# EAGLE design theremin_gross_mono (EAGLE 5.10)
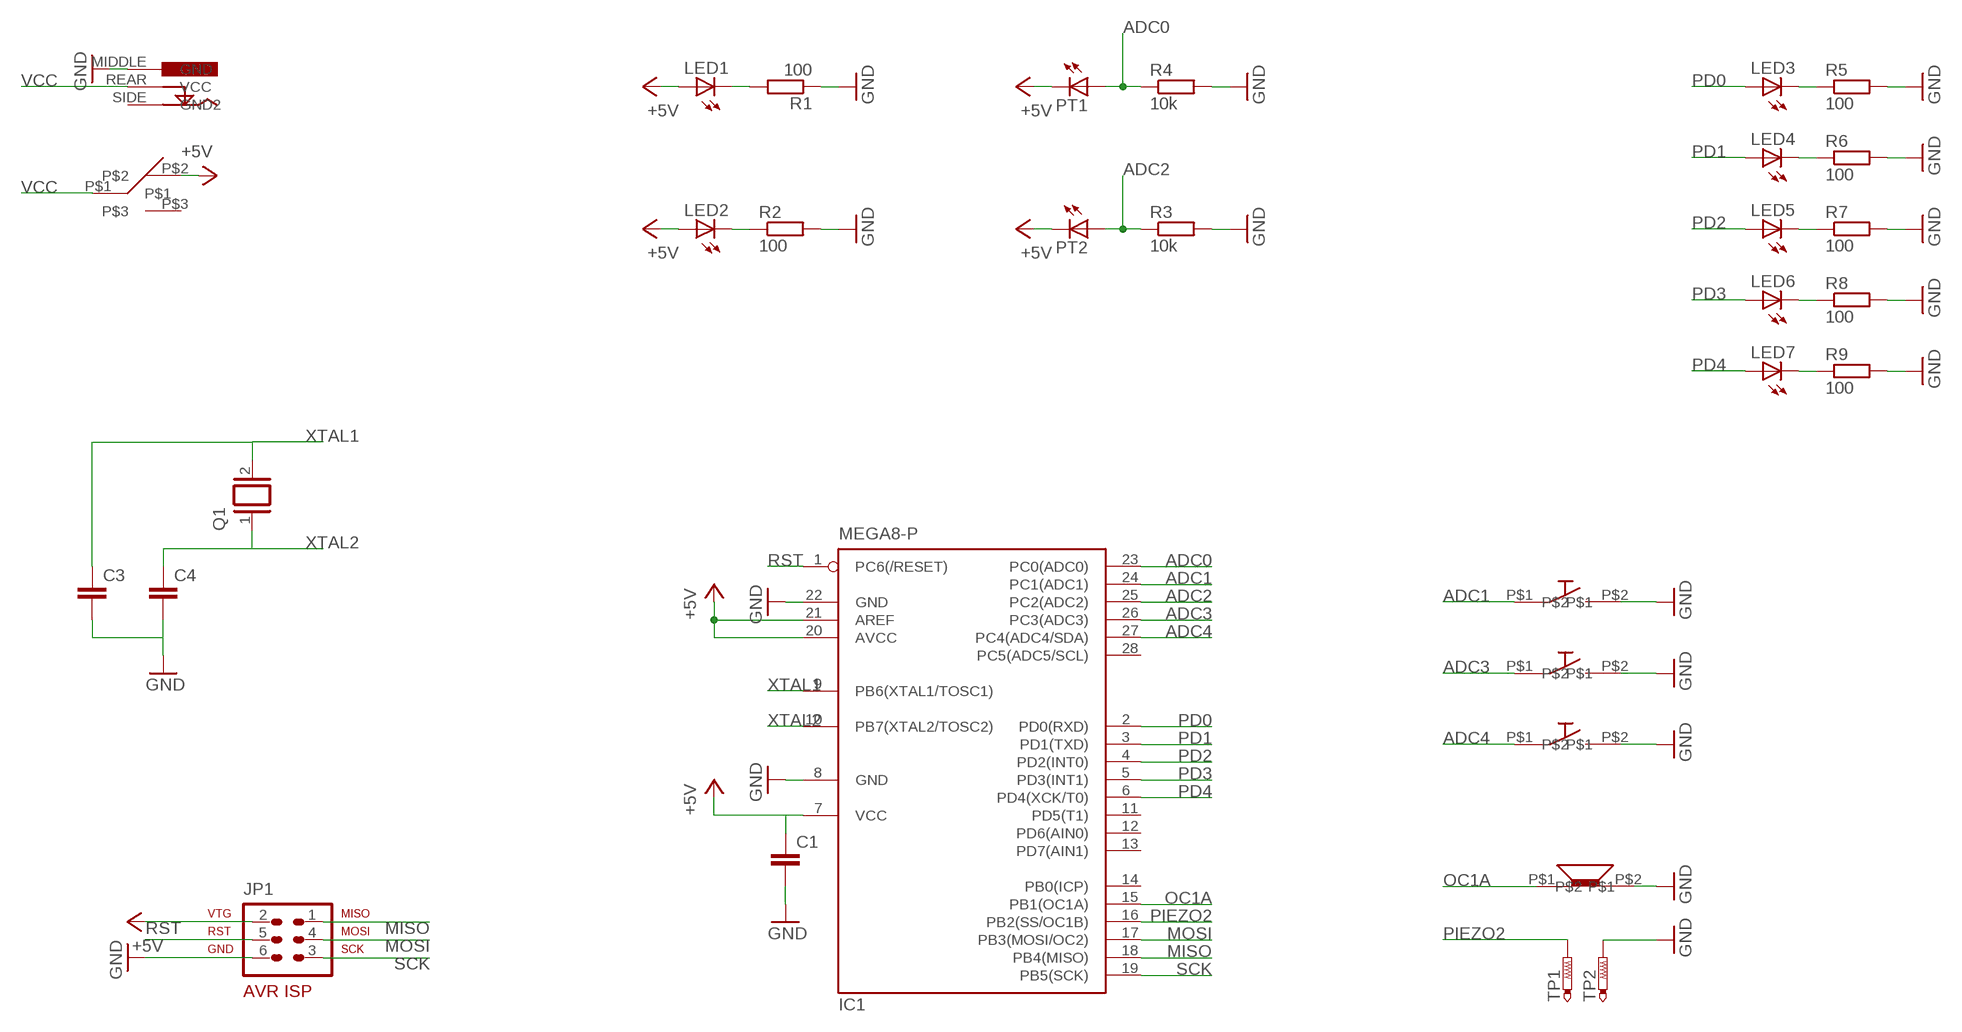
[diagram p0: schematic, sheet 1]

## Parts
C1  C-EU025-025X050  [C025-025X050]
C3  C-EU025-025X050  [C025-025X050]
C4  C-EU025-025X050  [C025-025X050]
IC1  MEGA8-P  [DIL28-3]
JP1  AVR-ISP-6  [AVR-ISP-6]
LED1  LED3MM  [LED3MM]
LED2  LED3MM  [LED3MM]
LED3  LED3MM  [LED3MM]
LED4  LED3MM  [LED3MM]
LED5  LED3MM  [LED3MM]
LED6  LED3MM  [LED3MM]
LED7  LED3MM  [LED3MM]
PT1  LED3MM  [LED3MM]
PT2  LED3MM  [LED3MM]
Q1  XTAL/S  [QS]
R1  100  R-EU_0207/10  [0207/10]
R2  100  R-EU_0207/10  [0207/10]
R3  10k  R-EU_0207/10  [0207/10]
R4  10k  R-EU_0207/10  [0207/10]
R5  100  R-EU_0207/10  [0207/10]
R6  100  R-EU_0207/10  [0207/10]
R7  100  R-EU_0207/10  [0207/10]
R8  100  R-EU_0207/10  [0207/10]
R9  100  R-EU_0207/10  [0207/10]
TP1  PTR1PAD1-20  [P1-20]
TP2  PTR1PAD1-20  [P1-20]
U$1  TASTER1032  [TASTER1032]
U$2  JACK-2.1MM  [JACK-2.1MM]
U$3  SCHALTER-KIP1PUM  [CSD-KIP1PUM]
U$4  PIEZO-A3  [PIEZO-A3]
U$6  TASTER1032  [TASTER1032]
U$7  TASTER1032  [TASTER1032]

## Nets
+5V: C1.1 IC1.7(VCC) IC1.20(AVCC) IC1.21(AREF) JP1.2 LED1.A LED2.A PT1.K(C) PT2.K(C) U$3.P$2
ADC0: IC1.23(PC0(ADC0)) PT1.A R4.1
ADC1: IC1.24(PC1(ADC1)) U$1.P$1
ADC2: IC1.25(PC2(ADC2)) PT2.A R3.1
ADC3: IC1.26(PC3(ADC3)) U$6.P$1
ADC4: IC1.27(PC4(ADC4/SDA)) U$7.P$1
GND: C1.2 C3.2 C4.2 IC1.8(GND) IC1.22(GND) JP1.6 R1.1 R2.2 R3.2 R4.2 R5.2 R6.2 R7.2 R8.2 R9.2 TP2.TP U$1.P$2 U$2.MIDDLE(GND) U$4.P$2 U$6.P$2 U$7.P$2
MISO: IC1.18(PB4(MISO)) JP1.1
MOSI: IC1.17(PB3(MOSI/OC2)) JP1.4
N$1: LED2.K(C) R2.1
N$2: LED1.K(C) R1.2
N$3: LED3.K(C) R5.1
N$5: LED4.K(C) R6.1
N$7: LED5.K(C) R7.1
N$9: LED6.K(C) R8.1
N$11: LED7.K(C) R9.1
OC1A: IC1.15(PB1(OC1A)) U$4.P$1
PD0: IC1.2(PD0(RXD)) LED3.A
PD1: IC1.3(PD1(TXD)) LED4.A
PD2: IC1.4(PD2(INT0)) LED5.A
PD3: IC1.5(PD3(INT1)) LED6.A
PD4: IC1.6(PD4(XCK/T0)) LED7.A
PIEZO2: IC1.16(PB2(SS/OC1B)) TP1.TP
RST: IC1.1(PC6(/RESET)) JP1.5
SCK: IC1.19(PB5(SCK)) JP1.3
VCC: U$2.REAR(VCC) U$3.P$1
XTAL1: C3.1 IC1.9(PB6(XTAL1/TOSC1)) Q1.2
XTAL2: C4.1 IC1.10(PB7(XTAL2/TOSC2)) Q1.1
Unconnected: IC1.11(PD5(T1)) IC1.12(PD6(AIN0)) IC1.13(PD7(AIN1)) IC1.14(PB0(ICP)) IC1.28(PC5(ADC5/SCL)) U$2.SIDE(GND2) U$3.P$3

## Library data of the parts
C1 C3 C4 = resistor:C-EU: CAPACITOR, European symbol
IC1 = atmel:MEGA8-P: MICROCONTROLLER 8 Kbytes FLASH, 1 kbytes SRAM, 512 bytes EEPROM, USART, 4-channel 10 bit ADC, 2-channel 8 bit ADC Pin compatible with Atmega48, ATMega88, ATMega168 Source: avr.lbr
JP1 = avr-6:AVR-ISP-6: AVR ISP-6 Serial Programming Header
LED1-LED7 PT1 PT2 = led:LED: LED OSRAM: - CHIPLED LG R971, LG N971, LY N971, LG Q971, LY Q971, LO R971, LY R971 LH N974, LH R974 LS Q976, LO Q976, LY Q976 LO Q996 - Hyper CHIPLED LW Q18S LB Q993, LB Q99A, LB R99A - SideLED LS A670, LO A670, LY A670, LG A670, LP A670 LB A673, LV A673, LT A673, LW A673 LH A674 LY A675 LS A676, LA A676, LO A676, LY A676, LW A676 LS A679, LY A679, LG A679 - Hyper Micro SIDELED® LS Y876, LA Y876, LO Y876, LY Y876 LT Y87S - SmartLED LW L88C, LW L88S LB L89C, LB L89S, LG L890 LS L89K, LO L89K, LY L89K LS L896, LA L896, LO L896, LY L896 - TOPLED LS T670, LO T670, LY T670, LG T670, LP T670 LSG T670, LSP T670, LSY T670, LOP T670, LYG T670 LG T671, LOG T671, LSG T671 LB T673, LV T673, LT T673, LW T673 LH T674 LS T676, LA T676, LO T676, LY T676, LB T676, LH T676, LSB T676, LW T676 LB T67C, LV T67C, LT T67C, LS T67K, LO T67K, LY T67K, LW E67C LS E67B, LA E67B, LO E67B, LY E67B, LB E67C, LV E67C, LT E67C LW T67C LS T679, LY T679, LG T679 LS T770, LO T770, LY T770, LG T770, LP T770 LB T773, LV T773, LT T773, LW T773 LH T774 LS E675, LA E675, LY E675, LS T675 LS T776, LA T776, LO T776, LY T776, LB T776 LHGB T686 LT T68C, LB T68C - Hyper Mini TOPLED® LB M676 - Mini TOPLED Santana® LG M470 LS M47K, LO M47K, LY M47K Source: http://www.osram.convergy.de LUXEON: - LUMILED® LXK2-PW12-R00, LXK2-PW12-S00, LXK2-PW14-U00, LXK2-PW14-V00 LXK2-PM12-R00, LXK2-PM12-S00, LXK2-PM14-U00 LXK2-PE12-Q00, LXK2-PE12-R00, LXK2-PE12-S00, LXK2-PE14-T00, LXK2-PE14-U00 LXK2-PB12-K00, LXK2-PB12-L00, LXK2-PB12-M00, LXK2-PB14-N00, LXK2-PB14-P00, LXK2-PB14-Q00 LXK2-PR12-L00, LXK2-PR12-M00, LXK2-PR14-Q00, LXK2-PR14-R00 LXK2-PD12-Q00, LXK2-PD12-R00, LXK2-PD12-S00 LXK2-PH12-R00, LXK2-PH12-S00 LXK2-PL12-P00, LXK2-PL12-Q00, LXK2-PL12-R00 Source: www.luxeon.com KINGBRIGHT: KA-3528ASYC Source: www.kingbright.com
Q1 = special:XTAL/S: CRYSTAL
R1-R9 = resistor:R-EU_: RESISTOR, European symbol
TP1 TP2 = testpad:PTR1: TEST PIN
U$1 U$6 U$7 = theremin:TASTER1032
U$2 = theremin:JACK-2.1MM
U$3 = theremin:SCHALTER-KIP1PUM
U$4 = theremin:PIEZO-A3: pui audio Transducer (Piezo) AT-5210-TT-R

## Board
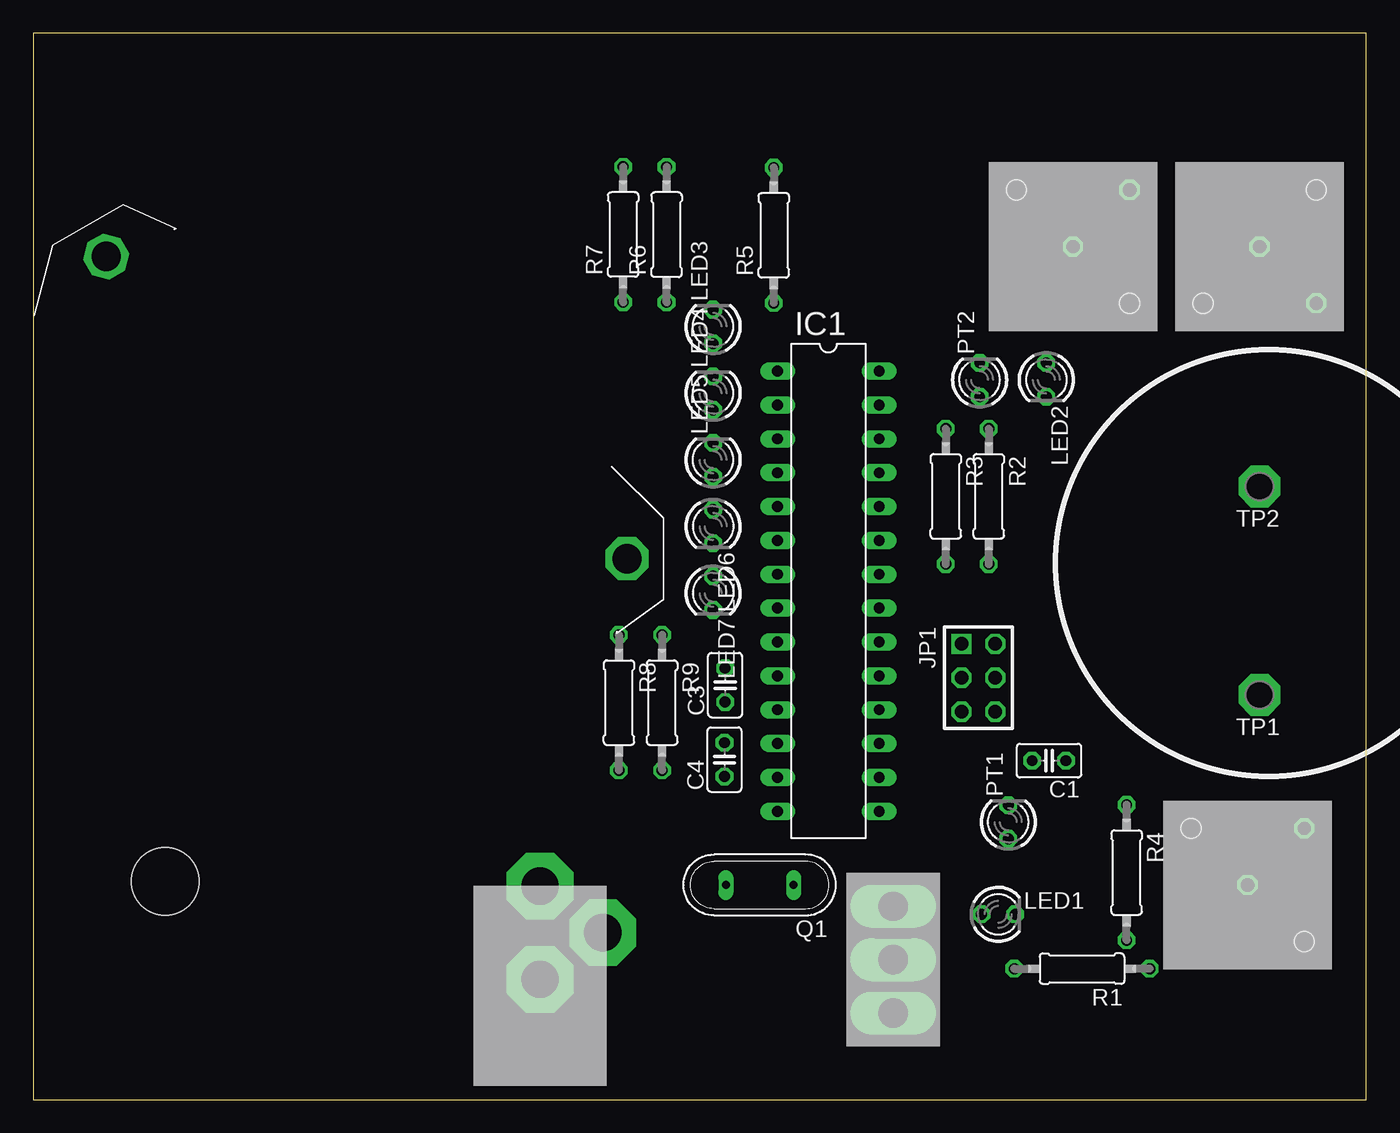
[diagram p1: board, top side]
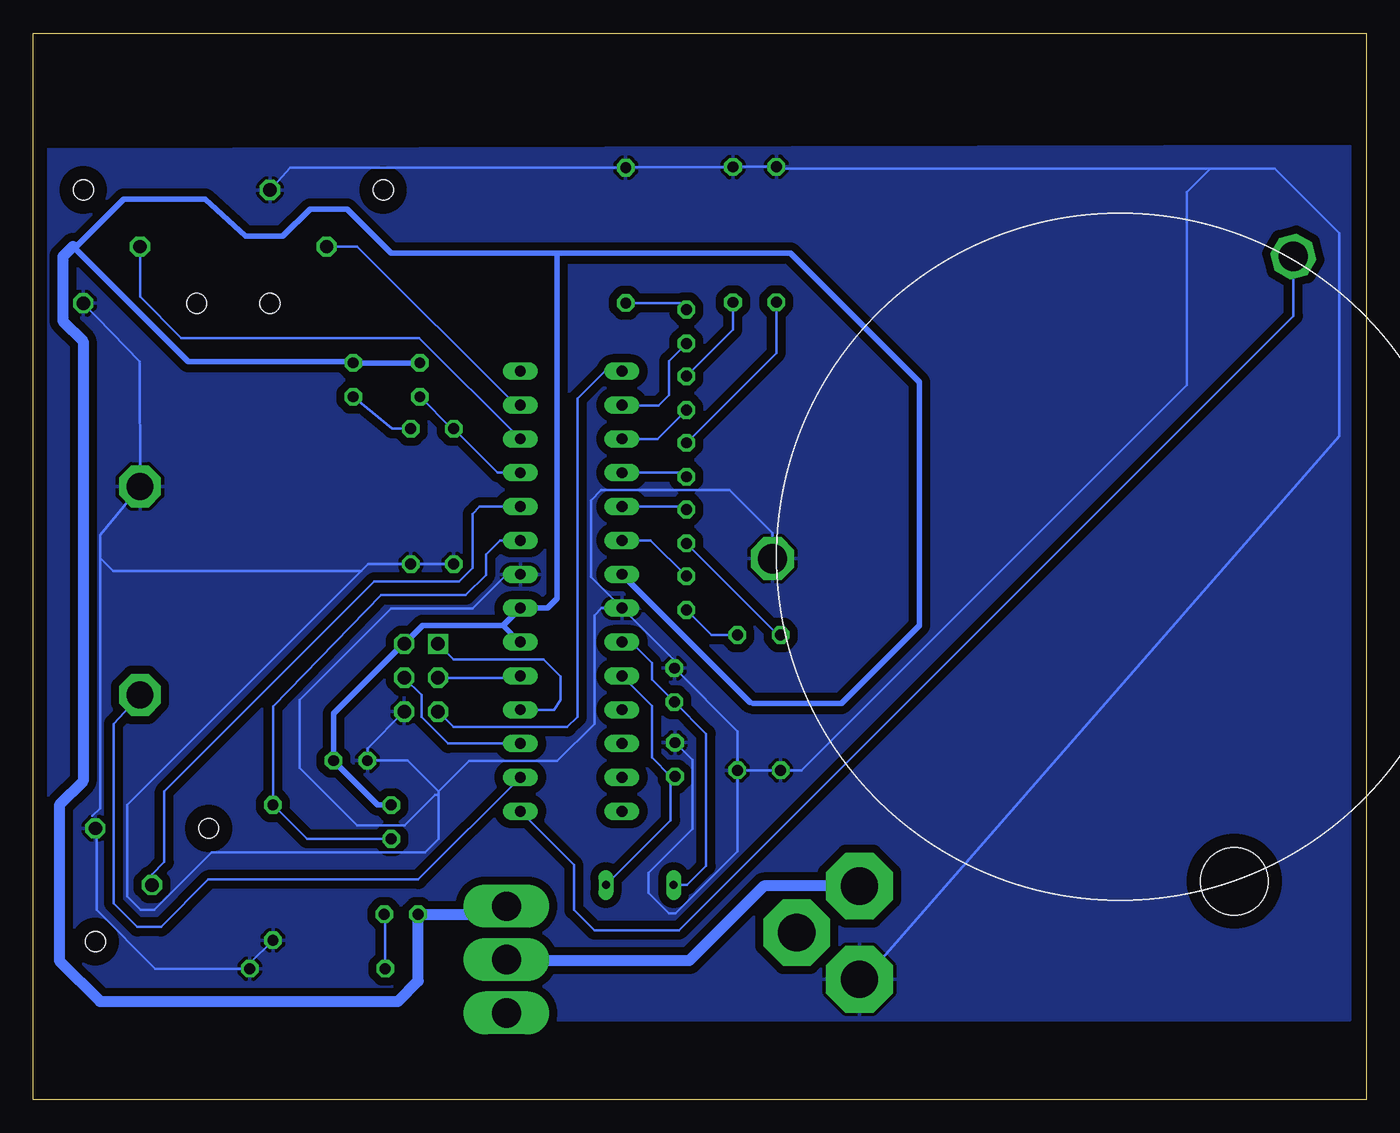
[diagram p2: board, bottom side, seen from below]

Size 100 x 80 mm. Coordinates in mm from the lower left corner, seen from the top.
Outline: 0,0 100,0 100,80 0,80 0,0
Copper layers (1*16): Top 0.035mm / dielectric 1.5mm / Bottom 0.035mm
Design rules "default": minimum track width 10mil, minimum drill 24mil, track to track 8mil, track to pad 8mil, pad to pad 8mil, via to via 8mil, smd to smd 8mil, copper to edge 40mil, drill to drill 8mil, minimum pad ring 10mil, minimum via ring 8mil, stop-mask expansion 4mil, vias tented up to drill 0mil, thermal gap 10mil

### Footprints (pad centres in the part's own frame; a part is rotated, then mirrored left to right if it is on the bottom)
C025-025X050 = drill 0.813 octagon: 1 -1.27,0; 2 1.27,0
DIL28-3 = drill 0.813 long: 1 -16.51,-3.81; 2 -13.97,-3.81; 3 -11.43,-3.81; 4 -8.89,-3.81; 5 -6.35,-3.81; 6 -3.81,-3.81; 7 -1.27,-3.81; 8 1.27,-3.81; 9 3.81,-3.81; 10 6.35,-3.81; 11 8.89,-3.81; 12 11.43,-3.81; 13 13.97,-3.81; 14 16.51,-3.81; 15 16.51,3.81; 16 13.97,3.81; 17 11.43,3.81; 18 8.89,3.81; 19 6.35,3.81; 20 3.81,3.81; 21 1.27,3.81; 22 -1.27,3.81; 23 -3.81,3.81; 24 -6.35,3.81; 25 -8.89,3.81; 26 -11.43,3.81; 27 -13.97,3.81; 28 -16.51,3.81
AVR-ISP-6 = drill 1.016 square: 1 -2.54,-1.27 | drill 1.016 octagon: 2 -2.54,1.27; 3 0,-1.27; 4 0,1.27; 5 2.54,-1.27; 6 2.54,1.27
LED3MM = drill 0.813 octagon: A -1.27,0; K 1.27,0
QS = drill 0.61 long: 1 -2.54,0; 2 2.54,0
0207/10 = drill 0.813 octagon: 1 -5.08,0; 2 5.08,0
P1-20 = drill 2.007 pad 3.15 octagon: TP 0,0
TASTER1032 = drill 1 octagon: P$1 0,0; P$2 4.25,4.25 | hole 1.5: -4.25,4.25; 4.25,-4.25
JACK-2.1MM = drill 2.8 pad 5 octagon: MIDDLE 8,-5; REAR 15,-5; SIDE 11.5,-9.7
CSD-KIP1PUM = drill 2.2 long: P$1 3.5,-6.5; P$2 3.5,-2.5; P$3 3.5,-10.5
PIEZO-A3 = drill 2.2 octagon: P$1 -12.822,22.868; P$2 26.261,0.196 | hole 5.08: -8.382,-24.003

### Placement (x,y rotation side)
C1  76.21,25.43 180 top
C3  51.91,31.1 90 top
C4  51.86,25.51 90 top
IC1  59.65,38.14 270 top
JP1  70.91,31.65 270 top
LED1  72.4,13.9 0 top
LED2  76,54 270 top
LED3  51,58 90 top
LED4  51,53 90 top
LED5  51,48 90 top
LED6  51,43 270 top
LED7  51,38 270 top
PT1  73.15,20.83 90 top
PT2  71,54 90 top
Q1  54.5,16.1 180 top
R1  78.68,9.82 180 top
R2  71.68,45.25 270 top
R3  68.46,45.25 270 top
R4  82.02,17.03 270 top
R5  55.55,64.84 90 top
R6  47.51,64.89 90 top
R7  44.25,64.91 90 top
R8  43.94,29.78 270 top
R9  47.17,29.78 270 top
TP1  92,30.36 180 top
TP2  92,46 180 top
U$1  91.1,16.1 0 top
U$2  33.02,1.02 90 top
U$3  61,17 0 top
U$4  18.29,40.39 0 top
U$6  92,64 270 top
U$7  78,64 0 top

### Tracks (layer width: path | path; a pad name or v marks a point on that pad's centre or on a via)
+5V
  Bottom 0.406: 60.71,63.5 60.71,37.59 61.43,36.87 IC1.21 64.77,35.56 | 64.77,35.56 70.8,35.56 JP1.2 72.24,34.19 77.47,28.96 C1.1 77.48,25.41 74.17,22.1 PT1.K | 96.9,63.88 97.03,64.01 | 96.9,63.88 88.39,55.37 76.1,55.37 LED2.A PT2.K | 60.71,63.5 43.18,63.5 33.53,53.85 33.53,35.56 39.37,29.72 45.97,29.72 46.23,29.8 IC1.7 | 60.71,63.5 73.15,63.5 76.45,66.8 79.25,66.8 81.28,64.77 84.07,64.77 87.12,67.56 93.22,67.56 96.9,63.88 | 64.77,35.56 63.54,34.33 IC1.20
  Bottom 0.813: U$3.P$2 65.1,13.9 LED1.A 71.12,8.89 72.64,7.37 95,7.37 98.04,10.41 98.04,22.1 96.27,23.88 96.27,56.9 97.79,58.42 97.79,63.25 97.03,64.01
ADC0
  Bottom 0.203: PT1.A 79.47,19.56 R4.1 82.02,29.48 73.91,37.85 67.56,37.85 66.04,39.37 66.04,40.89 64.98,41.95 IC1.23
ADC1
  Bottom 0.203: IC1.24 66.51,44.49 67.06,43.94 67.06,39.88 68.07,38.86 74.42,38.86 90.17,23.11 90.17,17.83 91.1,16.9 U$1.P$1
ADC2
  Bottom 0.203: IC1.25 65.16,47.03 R3.1 68.6,50.33 PT2.A
ADC3
  Bottom 0.203: IC1.26 71.04,57.15 88.9,57.15 92,60.25 U$6.P$1
ADC4
  Bottom 0.203: IC1.27 63.79,52.11 75.69,64.01 U$7.P$1
GND
  Bottom 0.203: U$7.P$2 80.73,69.92 R5.2 55.51,69.97 R6.2 47.49,69.99 R7.2 44.12,69.85 11.68,69.85 | U$6.P$2 92.01,55.36 TP2.TP 95,42.37 95,40.64 | 95,40.64 95,21.84 95.56,21.28 | 95.25,20.01 95.25,14.22 90.84,9.82 R1.1 83.76,10.21 R4.2 | 11.68,69.85 6.86,69.85 2.03,65.02 2.03,49.78 37.34,9.4 37.85,8.89 38.1,8.89 37.85,9.14 | 11.68,69.85 13.46,68.07 13.46,53.59 42.36,24.7 R8.2 R9.2 | R9.2 47.17,18.61 51.82,13.97 52.32,13.97 53.85,15.49 53.85,17.02 50.55,20.32 50.55,25.47 C4.2 | R9.2 47.17,27.63 C3.2 51.91,32.94 IC1.8 | IC1.8 58.17,39.2 58.17,44.96 57.4,45.72 47.75,45.72 44.55,42.52 U$4.P$2 | JP1.6 74.94,26.35 C1.2 71.91,25.43 69.6,23.11 | R3.2 R2.2 74.89,40.17 75.4,39.67 | 75.4,39.67 92.96,22.1 92.96,15.24 91.95,14.22 90.93,14.22 86.61,18.54 70.61,18.54 69.6,19.56 69.6,22.86 | 69.6,23.11 69.6,22.86 | 95,40.64 94.02,39.67 75.4,39.67 | IC1.8 57.36,36.87 57.91,36.32 57.91,28.19 60.71,25.4 67.31,25.4 69.6,23.11 | 69.6,22.86 69.85,22.86 72.14,20.57 75.69,20.57 80.01,24.89 80.01,29.97 73.15,36.83 67.06,36.83 64.48,39.41 IC1.22
  pour Bottom (isolate 0.61): 1.24,71.52 99,71.27 99,6 1.24,6
MISO
  Bottom 0.203: JP1.1 68.47,33.02 61.72,33.02 60.45,31.75 60.45,29.97 60.92,29.25 IC1.18
MOSI
  Bottom 0.203: IC1.17 68.87,26.71 70.87,28.7 70.87,30.34 JP1.4
N$1
  Bottom 0.203: R2.1 73.1,50.33 LED2.K
N$2
  Bottom 0.203: LED1.K 73.6,13.83 R1.2
N$3
  Bottom 0.203: LED3.K 51.49,59.76 R5.1
N$5
  Bottom 0.203: LED4.K 47.51,57.76 R6.1
N$7
  Bottom 0.203: LED5.K 44.25,56.02 R7.1
N$9
  Bottom 0.203: LED6.K 44.13,34.86 R8.1
N$11
  Bottom 0.203: LED7.K 49.13,34.86 R9.1
OC1A
  Bottom 0.203: IC1.15 59.44,17.61 59.44,14.22 57.91,12.7 51.56,12.7 5.47,58.8 U$4.P$1
PD0
  Bottom 0.203: LED3.A 52.32,55.41 52.32,52.84 53.09,52.07 55.8,52.07 IC1.2
PD1
  Bottom 0.203: LED4.A 53.16,49.57 IC1.3
PD2
  Bottom 0.203: LED5.A 51.3,47.03 IC1.4
PD3
  Bottom 0.203: LED6.A 51.22,44.49 IC1.5
PD4
  Bottom 0.203: LED7.A 53.68,41.95 IC1.6
PIEZO2
  Bottom 0.203: TP1.TP 93.98,28.19 93.98,14.73 92.2,12.95 90.42,12.95 86.87,16.51 71.12,16.51 IC1.16
RST
  Bottom 0.203: IC1.1 57.11,54.65 59.18,52.58 59.18,28.7 59.94,27.94 68.47,27.94 JP1.5
SCK
  Bottom 0.203: IC1.19 63.6,31.65 JP1.3
VCC
  Bottom 0.813: U$3.P$1 64.41,10.41 50.8,10.41 45.2,16.02 U$2.REAR
XTAL1
  Bottom 0.203: Q1.2 50.96,16.1 49.53,17.53 49.53,27.45 C3.1 53.59,31.51 53.59,32.77 55.16,34.33 IC1.9
XTAL2
  Bottom 0.203: IC1.10 53.59,29.54 53.59,25.65 52.18,24.24 | 52.18,24.24 C4.1 | 52.18,24.24 52.18,20.96 Q1.1